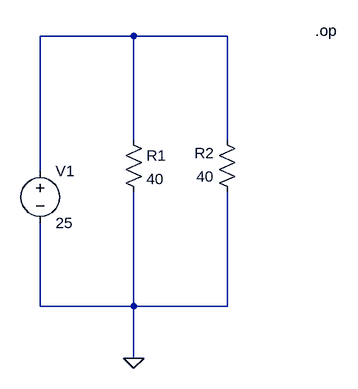
[diagram p0: schematic open.asc]
open.asc, the LTspice schematic file:
Version 4
SHEET 1 880 680
WIRE 192 -16 48 -16
WIRE 336 -16 192 -16
WIRE 192 144 192 -16
WIRE 336 144 336 -16
WIRE 48 192 48 -16
WIRE 48 400 48 272
WIRE 192 400 192 224
WIRE 192 400 48 400
WIRE 336 400 336 224
WIRE 336 400 192 400
WIRE 192 480 192 400
FLAG 192 480 0
SYMBOL voltage 48 176 R0
SYMATTR InstName V1
SYMATTR Value 25
SYMBOL res 176 128 R0
SYMATTR InstName R1
SYMATTR Value 40
SYMBOL res 352 240 R180
WINDOW 0 36 76 Left 2
WINDOW 3 36 40 Left 2
SYMATTR InstName R2
SYMATTR Value 40
TEXT 472 -24 Left 2 !.op

The netlist it stands for:
* open.asc
V1 N001 0 25
R1 N001 0 40
R2 0 N001 40
.op
.backanno
.end